# Altium project CR99004.PrjPCB
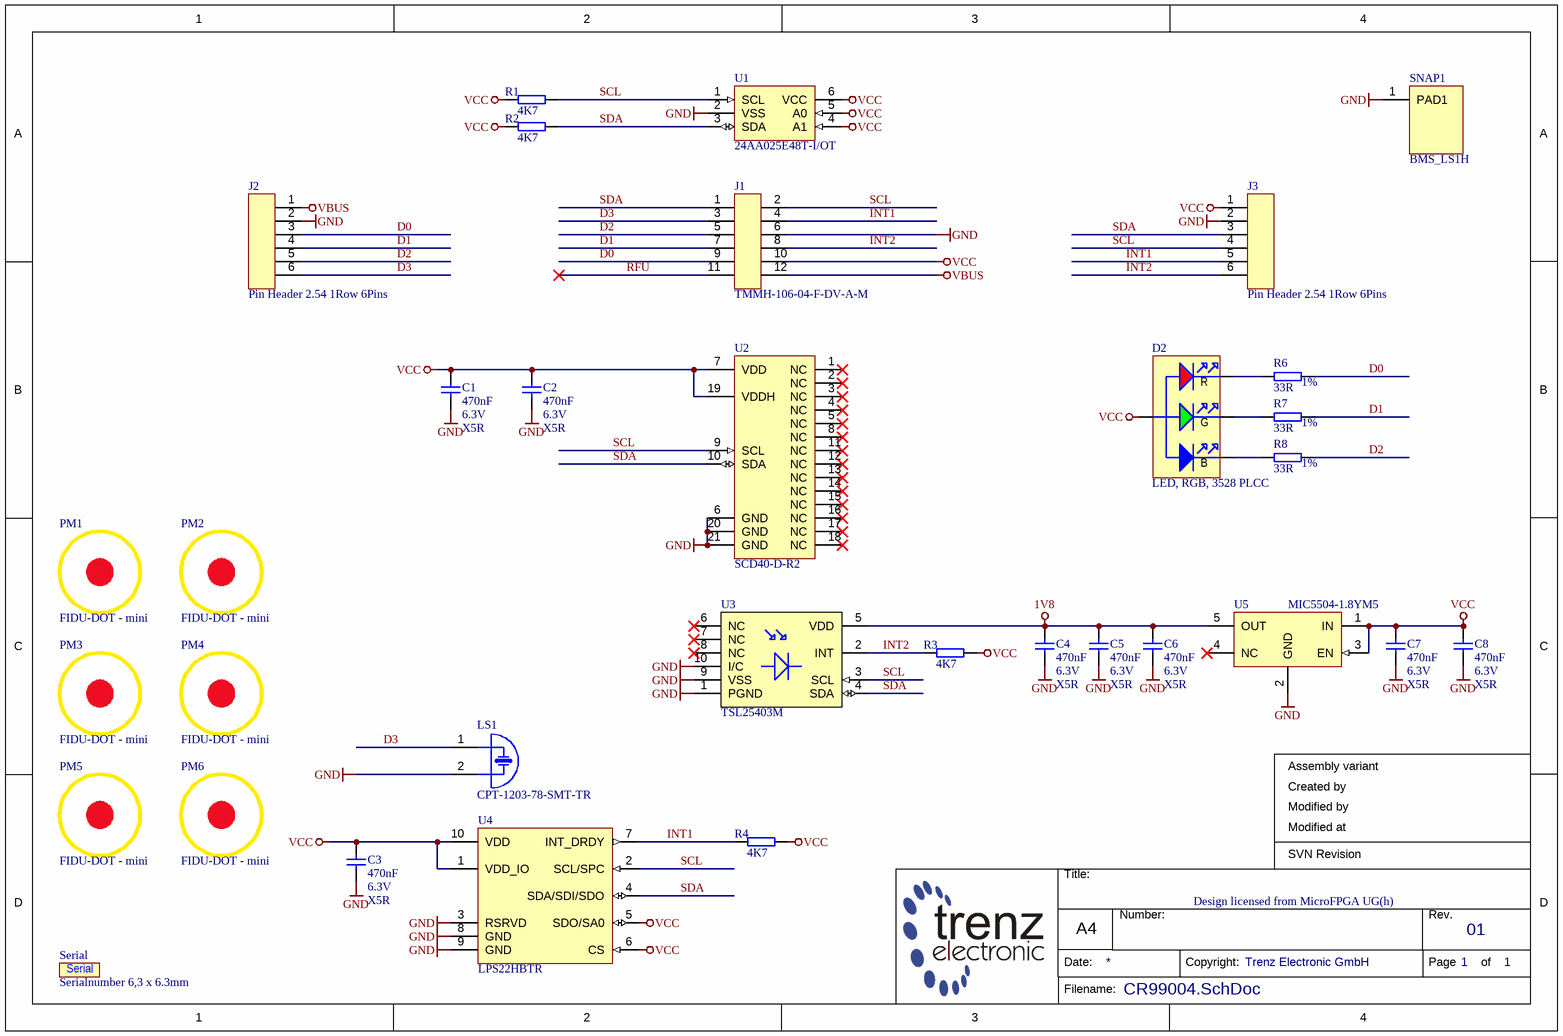
[diagram p0: CR99004.SchDoc]
Project: CR00040; Revision: 02
1 sheet, 33 parts. Net scope: global (net labels, ports and power ports of the same name join across sheets).
Board file: CR99004.PcbDoc

## Sheet CR99004.SchDoc
size A4; Organization: Trenz Electronic GmbH; Revision: 01; SheetNumber: 1; SheetTotal: 1

### Parts
C1  470nF  Voltage: 6.3V  Technology: X5R  [CAPC0603X33N_V]
C2  470nF  Voltage: 6.3V  Technology: X5R  [CAPC0603X33N_V]
C3  470nF  Voltage: 6.3V  Technology: X5R  [CAPC0603X33N_V]
C4  470nF  Voltage: 6.3V  Technology: X5R  [CAPC0603X33N_V]
C5  470nF  Voltage: 6.3V  Technology: X5R  [CAPC0603X33N_V]
C6  470nF  Voltage: 6.3V  Technology: X5R  [CAPC0603X33N_V]
C7  470nF  Voltage: 6.3V  Technology: X5R  [CAPC0603X33N_V]
C8  470nF  Voltage: 6.3V  Technology: X5R  [CAPC0603X33N_V]
D2  LED, RGB, 3528 PLCC  [PLCC150P360X280X190-4N-WE]
J1  TMMH-106-04-F-DV-A-M  [TMMH-106-04-T-DV-A]
J2  Pin Header 2.54 1Row 6Pins  [STIFTLEISTE2_54 OG 1R-6]
J3  Pin Header 2.54 1Row 6Pins  [STIFTLEISTE2_54 OG 1R-6]
LS1  CPT-1203-78-SMT-TR  [CPT-1203-78-SMT]
PM1  FIDU-DOT - mini  [FIDU-DOT - mini]
PM2  FIDU-DOT - mini  [FIDU-DOT - mini]
PM3  FIDU-DOT - mini  [FIDU-DOT - mini]
PM4  FIDU-DOT - mini  [FIDU-DOT - mini]
PM5  FIDU-DOT - mini  [FIDU-DOT - mini]
PM6  FIDU-DOT - mini  [FIDU-DOT - mini]
R1  4K7  [RESC1005X40N_V]
R2  4K7  [RESC1005X40N_V]
R3  4K7  [RESC1005X40N_V]
R4  4K7  [RESC1005X40N_V]
R6  33R  Tolerance: 1%  [RESC1005X40N_V]
R7  33R  Tolerance: 1%  [RESC1005X40N_V]
R8  33R  Tolerance: 1%  [RESC1005X40N_V]
Serial  Serialnumber 6,3 x 6.3mm  [Serial_6.3x6.3mm]  (no BOM)
SNAP1  BMS_LS1H  [BMS_LS1H]  (no BOM)
U1  24AA025E48T-I/OT  [SOT95P280X145-6N]
U2  SCD40-D-R2  [PQFN125P1010X1010X680-21T480X480N]
U3  TSL25403M  [QFN50P200X200X55-10N]
U4  LPS22HBTR  [PQFN50P200X200X80-10N]
U5  MIC5504-1.8YM5  [SOT95P280X145-5N]

### Nets
1V8: C4.2 C5.2 C6.2 U3.5(VDD) U5.5(OUT)
GND: C1.2 C2.2 C3.2 C4.1 C5.1 C6.1 C7.1 C8.1 J1.6 J2.2 J3.2 LS1.2(K) SNAP1.1(PAD1) U1.2(VSS) U2.6(GND) U2.20(GND) U2.21(GND) U3.1(PGND) U3.9(VSS) U3.10(I/C) U4.3(RSRVD) U4.8(GND) U4.9(GND) U5.2(GND)
VBUS: J1.12 J2.1
VCC: C1.1 C2.1 C3.1 C7.2 C8.2 D2.1(ANODE) J1.10 J3.1 R1.1 R2.1 R3.2 R4.2 U1.4(A1) U1.5(A0) U1.6(VCC) U2.7(VDD) U2.19(VDDH) U4.1(VDD_IO) U4.5(SDO/SA0) U4.6(CS) U4.10(VDD) U5.1(IN) U5.3(EN)
D0: J1.9 J2.3 R6.2
D1: J1.7 J2.4 R7.2
D2: J1.5 J2.5 R8.2
D3: J1.3 J2.6 LS1.1(A)
INT1: J1.4 J3.5 R4.1 U4.7(INT_DRDY)
INT2: J1.8 J3.6 R3.1 U3.2(INT)
RFU: J1.11
SCL: J1.2 J3.4 R1.2 U1.1(SCL) U2.9(SCL) U3.3(SCL) U4.2(SCL/SPC)
SDA: J1.1 J3.3 R2.2 U1.3(SDA) U2.10(SDA) U3.4(SDA) U4.4(SDA/SDI/SDO)
NetD2_2: D2.2(BLUE) R8.1
NetD2_3: D2.3(RED) R6.1
NetD2_4: D2.4(GREEN) R7.1

Not connected (* = marked no-connect by the designer): U2 1(NC)* 2(NC)* 3(NC)* 4(NC)* 5(NC)* 8(NC)* 11(NC)* 12(NC)* 13(NC)* 14(NC)* 15(NC)* 16(NC)* 17(NC)* 18(NC)*; U3 6(NC)* 7(NC)* 8(NC)*; U5 4(NC)*

### Notes on the sheet
- Assembly variant
- Created by
- Modified at
- Modified by
- Design licensed from MicroFPGA UG(h)
- SVN Revision
- Title:
- Number:
- Rev.
- Date:
- A4
- Copyright:
- Page
- of
- Filename:
- (in symbol 26741) R; G; B

### Library data of the parts
C1-C8 = 24921: KON 470nF 6.3V X5R 20%  SMD BF 0603 (0201); AN: 24921; Mixed: SMT; Value: 470n; Preferred: Yes; Temperature-Range: -55/+85; Case: 0603 (0201); Tolerance: 20%
D2 = 26741: Chip LED RGB; AN: 26741; Mixed: SMT; Temperature-Range: -40/+85; Case: 1411 (3528) PLCC; HelpURL: B:\ad\adlib\datasheet\150141M173100; H-ART: 150141M173100; Extra: 150141M173100
J1 = 28976: AN: 28976; Mixed: SMT; Extra: 12 pin 1.91mm 2  mm SMT Header; HelpURL: b:\AD\adlib\datasheet\Samtec_TMMH\; H-ART: TMMH-106-04-F-DV-A-M
J2 J3 = 28042: Stiftleiste gerade 1-reihig, 6pol; AN: 28042; Mixed: THT; Extra: 2,54mm RM, 11,3mm Stiftlänge, vergoldet; H-ART: 943-12-006-00
LS1 = 30856: Buzzers Transducer, Piezo, SMT; AN: 30856; Voltage: 5V; Temperature-Range: -40/+85; Extra: Externally Driven; Mixed: SMT; HelpURL: b:\AD\adlib\datasheet\CUI_Devices\; H-ART: CPT-1203-78-SMT-TR; Storage-Temperature: -40/+85
PM1-PM6 = 27037: FIDU-DOT - MINI 0.5mm; AN: 27037; Mixed: FIDU
R1-R4 = 22585: WID SMD 4K7 1% 0,063W BF 1005 (0402); AN: 22585; Mixed: SMT; Value: 4.7K; Preferred: Yes; H-ART: RC0402FR-134K7L; Tolerance: 1%; Case: 1005 (0402); Technology: TK100
R6-R8 = 22770: WID SMD 33R 1% 0,063W BF 1005 (0402); AN: 22770; Mixed: SMT; Value: 33; Preferred: Yes; H-ART: RC0402FR-0733RL; Case: 1005 (0402); Technology: TK100
Serial = 26753: AN: 26753; H-ART: 39068; Mixed: MECH; Extra: THT-70-718-20
U1 = 26249: AN: 26249; Mixed: SMT; Temperature-Range: -40/+85; Extra: 2K i2c Serial EEPROM with EUI-48; Case: SOT23-6; HelpURL: B:\AD\adlib\datasheet\24AA02xExx; H-ART: 24AA025E48T-I/OT
U2 = 30852: AN: 30852; Temperature-Range: -10/+60 (Abs); Extra: CO2, Temperature and Humidity I2C sensor; Mixed: SMT; Case: PQFN20; HelpURL: b:\AD\adlib\datasheet\Sensirion\SCD4x\; H-ART: SCD40-D-R2; Storage-Temperature: 10/+50
U3 = 30849: AN: 30849; Mixed: SMT; Temperature-Range: -30/+85; Extra: Optical Sensor Ambient I²C 10-UFQFN; Case: UFQFN10; HelpURL: b:\AD\adlib\datasheet\AMS\TSL2540\; H-ART: TSL25403M; Storage-Temperature: -40/+85 (Abs)
U4 = 30857: Pressure Sensor; AN: 30857; Mixed: SMT; Temperature-Range: -40/+85; Extra: MEMS 260-1260 hPa; Case: WFLGA10; HelpURL: b:\AD\adlib\datasheet\STMicroelectronics\LPS22HB\; H-ART: LPS22HBTR; Storage-Temperature: -40/+125 (Abs)
U5 = 28898: AN: 28898; Voltage: 1.8V; Mixed: SMT; Extra: 5.5V (In) 300mA Fixed Output 1.8V LDO; Case: SOT23-5; HelpURL: b:\AD\adlib\datasheet\MIC550x\; H-ART: MIC5504-1.8YM5

## Assembly variants
default: not fitted J2 J3
0: not fitted J2 J3 U2
40: not fitted J2 J3
41: not fitted J2 J3; alternate parts U2 -> 30952